# Altium schematic sheet Led Status.SchDoc
size A3; SheetNumber: 7; SheetTotal: 8
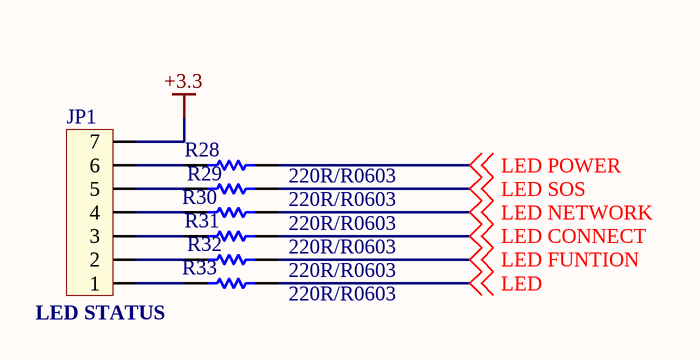
[diagram p0: Led Status.SchDoc]

## Parts
JP1  LED STATUS  [LED_VIEW_SMD]
R28  220R/R0603  [R0603]
R29  220R/R0603  [R0603]
R30  220R/R0603  [R0603]
R31  220R/R0603  [R0603]
R32  220R/R0603  [R0603]
R33  220R/R0603  [R0603]

## Nets
+3.3: JP1.7
LED: R33.2 ; off-sheet LED
LED CONNECT: R31.2 ; off-sheet LED CONNECT
LED FUNTION: R32.2 ; off-sheet LED FUNTION
LED NETWORK: R30.2 ; off-sheet LED NETWORK
LED POWER: R28.2 ; off-sheet LED POWER
LED SOS: R29.2 ; off-sheet LED SOS
NetJP1_1: JP1.1 R33.1
NetJP1_2: JP1.2 R32.1
NetJP1_3: JP1.3 R31.1
NetJP1_4: JP1.4 R30.1
NetJP1_5: JP1.5 R29.1
NetJP1_6: JP1.6 R28.1

## Notes on the sheet
- Title
- Size:
- Date:
- A3
- Number:
- Time:
- Revision:
- Sheet
- of
- NICHIETSUVN.COM <http://NICHIETSUVN.COM>
- R&D
- File:

## Library data of the parts
JP1 = Header7: Connector 7; Value: Connector 7
R28-R33 = 220R/R0603/1%: RES SMD 220 OHM 1% 1/10W 0603; Manufacturer: Yageo; Manufacturer Part Number: RC0603JR-07220RL; Resistance (Ohms): 220; Power (Watts): 0.1W, 1/10W; Temperature Coefficient: ±100ppm/°C; Supplier 1: Digi-Key; RoHS: RoHS Compliant; Category: Resistors; Stock 1: 317086; Pricing 1: 1=0.1, 10=0.011, 25=0.008, 100=0.0044, 250=0.00336, 500=0.0027, 1000=0.00198, 2500=0.00172 (USD); Packaging: Cut Tape (CT); Tolerance: ±1%; Composition: Thick Film; Features: Moisture Resistant; Operating Temperature: -55°C ~ 155°C; Package / Case: 0603 (1608 Metric); Supplier Device Package: 0603; Size / Dimension: 0.063" L x 0.031" W (1.60mm x 0.80mm); Height: 0.022" (0.55mm); Number of Terminations: 2; ComponentLink1URL: http://www.yageo.com/NewPortal/yageodocoutput?fileName=/pdf/R-Chip/PYu-RC_Group_51_RoHS_L_3.pdf; ComponentLink1Description: http://www.yageo.com/NewPortal/yageodocoutput?fileName=/pdf/R-Chip/PYu-RC_Group_51_RoHS_L_3.pdf; Supplier Part Number 1: 311-220GRCT-ND